# EAGLE schematic supersaw (EAGLE 6.5.0)

## Sheet 1 of 2
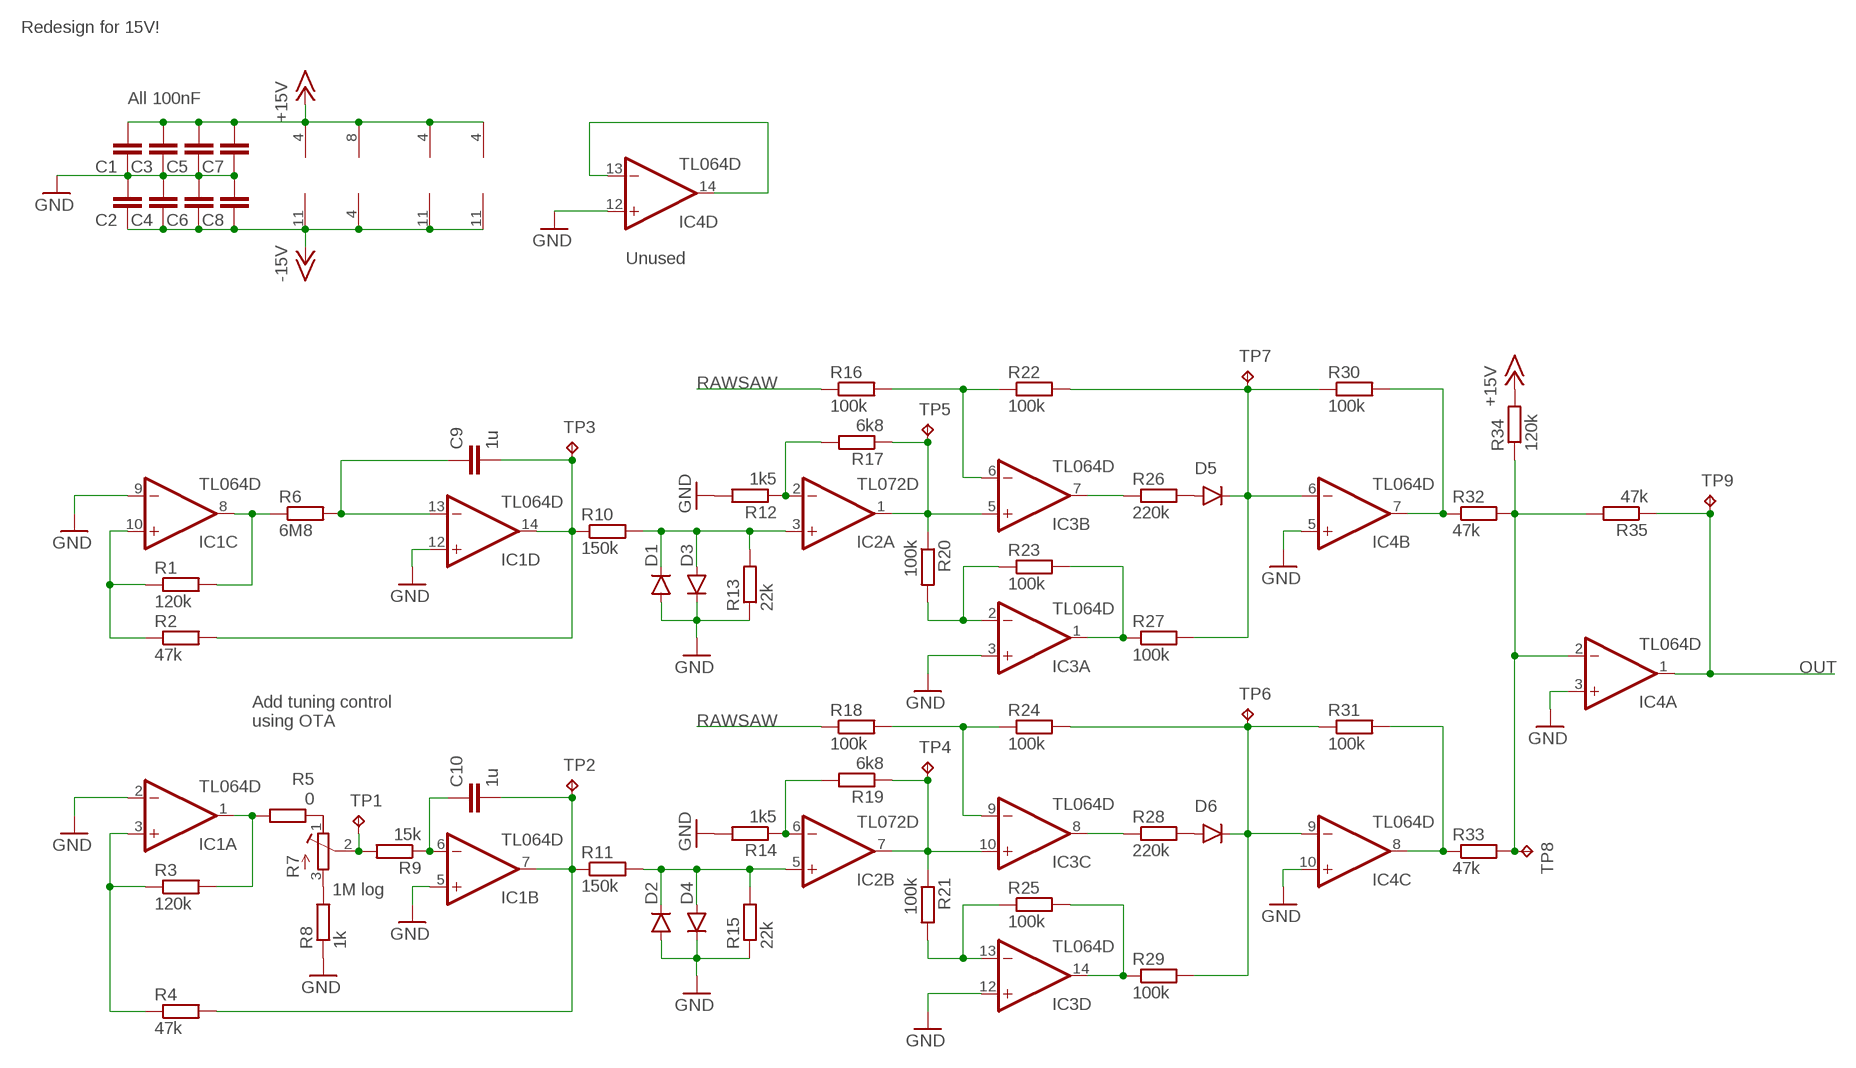
[diagram p0: schematic, sheet 1]

### Parts
C1  100n  C-EUC0805  [C0805]
C2  100n  C-EUC0805  [C0805]
C3  100n  C-EUC0805  [C0805]
C4  100n  C-EUC0805  [C0805]
C5  100n  C-EUC0805  [C0805]
C6  100n  C-EUC0805  [C0805]
C7  100n  C-EUC0805  [C0805]
C8  100n  C-EUC0805  [C0805]
C9  1u  C-EUC0805  [C0805]
C10  1u  C-EUC0805  [C0805]
D1  1N41480805  [D0805-J]
D2  1N41480805  [D0805-J]
D3  1N41480805  [D0805-J]
D4  1N41480805  [D0805-J]
D5  1N41480805  [D0805-J]
D6  1N41480805  [D0805-J]
IC1  TL064D  [SO14]
IC2  TL072D  [SO08J]
IC3  TL064D  [SO14]
IC4  TL064D  [SO14]
R1  120k  R-EU_R0805  [R0805]
R2  47k  R-EU_R0805  [R0805]
R3  120k  R-EU_R0805  [R0805]
R4  47k  R-EU_R0805  [R0805]
R5  0  R-EU_R0805  [R0805]
R6  6M8  R-EU_R0805  [R0805]
R7  1M log  R-TRIMMT93XA  [RTRIMT93XA]
R8  1k  R-EU_R0805  [R0805]
R9  15k  R-EU_R0805  [R0805]
R10  150k  R-EU_R0805  [R0805]
R11  150k  R-EU_R0805  [R0805]
R12  1k5  R-EU_R0805  [R0805]
R13  22k  R-EU_R0805  [R0805]
R14  1k5  R-EU_R0805  [R0805]
R15  22k  R-EU_R0805  [R0805]
R16  100k  R-EU_R0805  [R0805]
R17  6k8  R-EU_R0805  [R0805]
R18  100k  R-EU_R0805  [R0805]
R19  6k8  R-EU_R0805  [R0805]
R20  100k  R-EU_R0805  [R0805]
R21  100k  R-EU_R0805  [R0805]
R22  100k  R-EU_R0805  [R0805]
R23  100k  R-EU_R0805  [R0805]
R24  100k  R-EU_R0805  [R0805]
R25  100k  R-EU_R0805  [R0805]
R26  220k  R-EU_R0805  [R0805]
R27  100k  R-EU_R0805  [R0805]
R28  220k  R-EU_R0805  [R0805]
R29  100k  R-EU_R0805  [R0805]
R30  100k  R-EU_R0805  [R0805]
R31  100k  R-EU_R0805  [R0805]
R32  47k  R-EU_R0805  [R0805]
R33  47k  R-EU_R0805  [R0805]
R34  120k  R-EU_R0805  [R0805]
R35  47k  R-EU_R0805  [R0805]
TP1  TPB2,54  [B2,54]
TP2  TPB2,54  [B2,54]
TP3  TPB2,54  [B2,54]
TP4  TPB2,54  [B2,54]
TP5  TPB2,54  [B2,54]
TP6  TPB2,54  [B2,54]
TP7  TPB2,54  [B2,54]
TP8  TPB2,54  [B2,54]
TP9  TPB2,54  [B2,54]

### Nets
+15V: C1.2 C3.2 C5.2 C7.2 IC1.4(P:V+) IC2.8(P:V+) IC3.4(P:V+) IC4.4(P:V+) R34.2
-15V: C2.1 C4.1 C6.1 C8.1 IC1.11(P:V-) IC2.4(P:V-) IC3.11(P:V-) IC4.11(P:V-)
GND: C1.1 C2.2 C3.1 C4.2 C5.1 C6.2 C7.1 C8.2 D1.A D2.A D3.C D4.C IC1.2(A:-IN) IC1.5(B:+IN) IC1.9(C:-IN) IC1.12(D:+IN) IC3.3(A:+IN) IC3.12(D:+IN) IC4.3(A:+IN) IC4.5(B:+IN) IC4.10(C:+IN) IC4.12(D:+IN) R8.1 R12.2 R13.1 R14.2 R15.1
N$1: IC4.13(D:-IN) IC4.14(D:OUT)
N$6: IC1.10(C:+IN) R1.1 R2.1
N$7: IC1.3(A:+IN) R3.1 R4.1
N$8: IC1.8(C:OUT) R1.2 R6.1
N$9: C9.1 IC1.13(D:-IN) R6.2
N$10: D1.C D3.A IC2.3(A:+IN) R10.2 R13.2
N$11: IC1.1(A:OUT) R3.2 R5.2
N$12: C9.2 IC1.14(D:OUT) R2.2 R10.1 TP3.TP
N$13: R7.2(S) R9.2 TP1.TP
N$14: C10.1 IC1.6(B:-IN) R9.1
N$15: R7.3(E) R8.2
N$16: R5.1 R7.1(A)
N$17: C10.2 IC1.7(B:OUT) R4.2 R11.1 TP2.TP
N$18: D5.C IC4.6(B:-IN) R22.2 R27.2 R30.1 TP7.TP
N$19: D2.C D4.A IC2.5(B:+IN) R11.2 R15.2
N$20: D6.C IC4.9(C:-IN) R24.2 R29.2 R31.1 TP6.TP
N$21: IC2.2(A:-IN) R12.1 R17.2
N$22: IC2.6(B:-IN) R14.1 R19.2
N$23: IC2.1(A:OUT) IC3.5(B:+IN) R17.1 R20.1 TP5.TP
N$24: IC2.7(B:OUT) IC3.10(C:+IN) R19.1 R21.1 TP4.TP
N$25: IC3.6(B:-IN) R16.2 R22.1
N$26: IC3.7(B:OUT) R26.1
N$27: IC3.9(C:-IN) R18.2 R24.1
N$28: IC3.8(C:OUT) R28.1
N$29: D5.A R26.2
N$30: D6.A R28.2
N$31: IC3.1(A:OUT) R23.2 R27.1
N$32: IC3.14(D:OUT) R25.2 R29.1
N$33: IC3.2(A:-IN) R20.2 R23.1
N$34: IC4.2(A:-IN) R32.2 R33.2 R34.1 R35.2 TP8.TP
N$35: IC3.13(D:-IN) R21.2 R25.1
N$39: IC4.7(B:OUT) R30.2 R32.1
N$40: IC4.8(C:OUT) R31.2 R33.1
OUT: IC4.1(A:OUT) R35.1 TP9.TP
RAWSAW: R16.1 R18.1

### Notes on the sheet
- Redesign for 15V!
- All 100nF
- Unused
- Add tuning control
  using OTA

## Sheet 2 of 2

## Library data of the parts
C1-C10 = resistor:C-EU: CAPACITOR, European symbol
D1-D6 = joakim:1N4148: DIODE high speed (Philips)
IC1 IC3 IC4 = linear:TL064: OP AMP
IC2 = joakim:TL072: OP AMP
R1-R6 R8-R35 = resistor:R-EU_: RESISTOR, European symbol
R7 = resistor:R-TRIMM: Trimm resistor
TP1-TP9 = testpad:TP: Test pad